# Altium schematic sheet Jellyfish - MCU KL05.SchDoc
size A
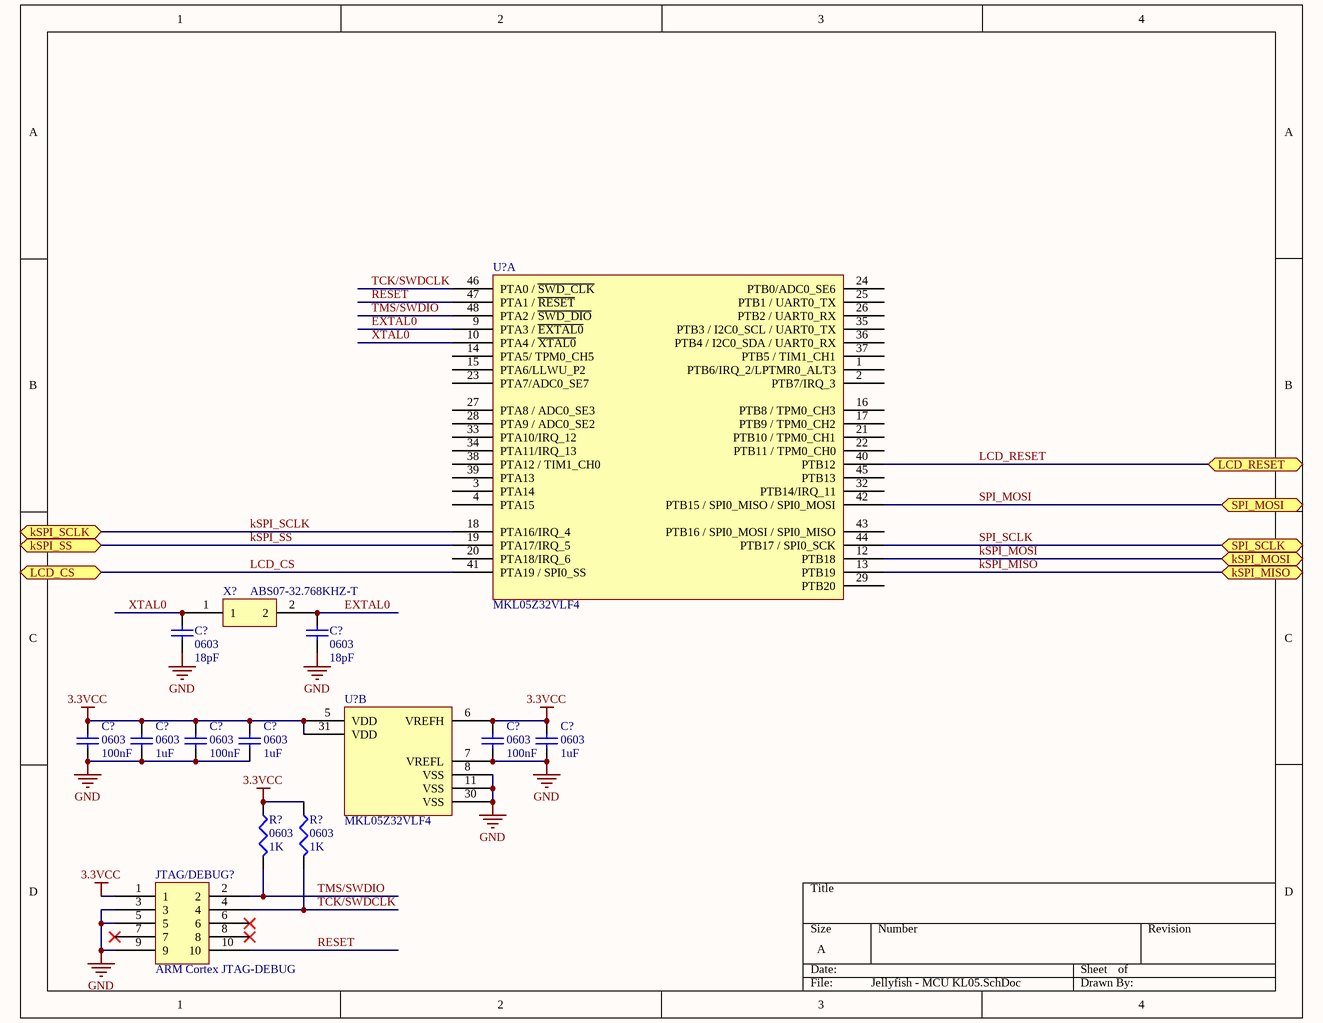
[diagram p0: Jellyfish - MCU KL05.SchDoc]

## Parts
(Parts that share a designator on the sheet are numbered #1, #2 ... from top to bottom, then left to right.)
C?#1  0603  value 18pF  [1608[0603]]
C?#2  0603  value 18pF  [1608[0603]]
C?#3  0603  value 100nF  [1608[0603]]
C?#4  0603  value 1uF  [1608[0603]]
C?#5  0603  value 100nF  [1608[0603]]
C?#6  0603  value 1uF  [1608[0603]]
C?#7  0603  value 100nF  [1608[0603]]
C?#8  0603  value 1uF  [1608[0603]]
JTAG/DEBUG?  ARM Cortex JTAG-DEBUG  [FTSH-105-XX-X-DV]
R?#1  0603  value 1K  [J1-0603]
R?#2  0603  value 1K  [J1-0603]
U?#1  MKL05Z32VLF4  [MKL05Z32VLF4]  (part A of 2)
U?#2  MKL05Z32VLF4  [MKL05Z32VLF4]  (part B of 2)
X?  ABS07-32.768KHZ-T  [ABS07-32.768KHZ-T]

## Ports
kSPI_MISO, kSPI_MOSI, kSPI_SCLK, kSPI_SS, LCD_CS, LCD_RESET, SPI_MOSI, SPI_SCLK

## Nets
3.3VCC: C?#3.1 C?#4.1 C?#5.2 C?#6.2 C?#7.2 C?#8.2 JTAG/DEBUG?.1 R?#1.1 R?#2.1 U?#2.5(VDD) U?#2.6(VREFH) U?#2.31(VDD)
GND: C?#1.2 C?#2.2 C?#3.2 C?#4.2 C?#5.1 C?#6.1 C?#7.1 C?#8.1 JTAG/DEBUG?.3 JTAG/DEBUG?.5 JTAG/DEBUG?.9 U?#2.7(VREFL) U?#2.8(VSS) U?#2.11(VSS) U?#2.30(VSS)
EXTAL0: C?#2.1 U?#1.9(PTA3_/_~{EXTAL0}) X?.2
kSPI_MISO: U?#1.13(PTB19) ; port kSPI_MISO
kSPI_MOSI: U?#1.12(PTB18) ; port kSPI_MOSI
kSPI_SCLK: U?#1.18(PTA16/IRQ_4) ; port kSPI_SCLK
kSPI_SS: U?#1.19(PTA17/IRQ_5) ; port kSPI_SS
LCD_CS: U?#1.41(PTA19_/_SPI0_SS) ; port LCD_CS
LCD_RESET: U?#1.40(PTB12) ; port LCD_RESET
RESET: JTAG/DEBUG?.10 U?#1.47(PTA1_/_~{RESET})
SPI_MOSI: U?#1.42(PTB15_/_SPI0_MISO_/_SPI0_MOSI) ; port SPI_MOSI
SPI_SCLK: U?#1.44(PTB17_/_SPI0_SCK) ; port SPI_SCLK
TCK/SWDCLK: JTAG/DEBUG?.4 R?#2.2 U?#1.46(PTA0_/_~{SWD_CLK})
TMS/SWDIO: JTAG/DEBUG?.2 R?#1.2 U?#1.48(PTA2_/_~{SWD_DIO})
XTAL0: C?#1.1 U?#1.10(PTA4_/_~{XTAL0}) X?.1

Not connected (* = marked no-connect by the designer): JTAG/DEBUG? 6* 7* 8*; U?#1 1(PTB6/IRQ_2/LPTMR0_ALT3) 2(PTB7/IRQ_3) 3(PTA14) 4(PTA15) 14(PTA5/_TPM0_CH5) 15(PTA6/LLWU_P2) 16(PTB8_/_TPM0_CH3) 17(PTB9_/_TPM0_CH2) 20(PTA18/IRQ_6) 21(PTB10_/_TPM0_CH1) 22(PTB11_/_TPM0_CH0) 23(PTA7/ADC0_SE7) 24(PTB0/ADC0_SE6) 25(PTB1_/_UART0_TX) 26(PTB2_/_UART0_RX) 27(PTA8_/_ADC0_SE3) 28(PTA9_/_ADC0_SE2) 29(PTB20) 32(PTB14/IRQ_11) 33(PTA10/IRQ_12) 34(PTA11/IRQ_13) 35(PTB3_/_I2C0_SCL_/_UART0_TX) 36(PTB4_/_I2C0_SDA_/_UART0_RX) 37(PTB5_/_TIM1_CH1) 38(PTA12_/_TIM1_CH0) 39(PTA13) 43(PTB16_/_SPI0_MOSI_/_SPI0_MISO) 45(PTB13)

## Library data of the parts
C?#1-C?#8 = Cap Semi: Capacitor (Semiconductor SIM Model); Published: 8-Jun-2000; LatestRevisionDate: 29-May-2009; LatestRevisionNote: IPC-7351 Footprint Added.; PackageReference: C1206; Publisher: Altium Limited; PackageDescription: Chip Capacitor
JTAG/DEBUG? = ARM Cortex JTAG-DEBUG Header
R?#1 R?#2 = Res3: Resistor; Published: 8-Jun-2000; LatestRevisionDate: 29-May-2009; LatestRevisionNote: IPC-7351 Footprint Added.; PackageReference: J1-0603; Publisher: Altium Limited; PackageDescription: Chip Resistor
U?#1 U?#2 = MKL05Z32VLF4: ARM Cortex M0+
X? = ABS07-32.768KHZ-T: ABS07-32.768KHZ-T RTC Crystal Oscillator